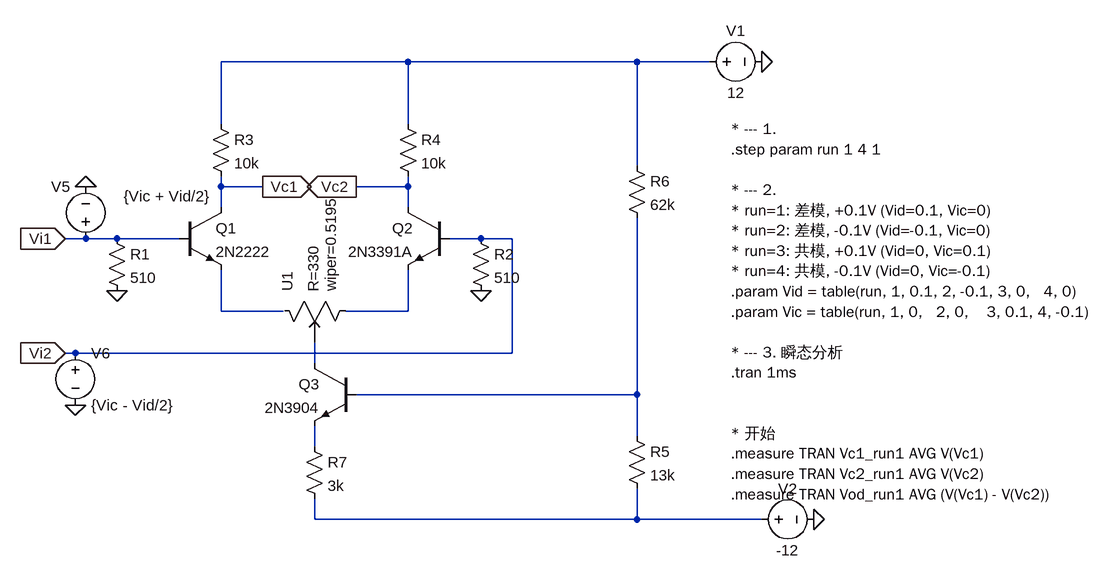
[diagram p0: schematic DifferentialAmplifierCircuit_dif_com_input.asc]
DifferentialAmplifierCircuit_dif_com_input.asc, the LTspice schematic file:
Version 4.1
SHEET 1 1044 1840
WIRE -48 -176 -336 -176
WIRE 304 -176 -48 -176
WIRE 416 -176 304 -176
WIRE -336 -80 -336 -176
WIRE -48 -80 -48 -176
WIRE 304 -16 304 -176
WIRE -336 16 -336 0
WIRE -272 16 -336 16
WIRE -48 16 -48 0
WIRE -48 16 -128 16
WIRE -336 48 -336 16
WIRE -48 48 -48 16
WIRE -544 96 -576 96
WIRE -496 96 -544 96
WIRE -400 96 -496 96
WIRE 64 96 16 96
WIRE 112 96 64 96
WIRE -336 208 -336 144
WIRE -240 208 -336 208
WIRE -48 208 -48 144
WIRE -48 208 -144 208
WIRE -560 272 -576 272
WIRE 112 272 112 96
WIRE 112 272 -560 272
WIRE -192 288 -192 256
WIRE 304 336 304 64
WIRE 304 336 -128 336
WIRE 304 400 304 336
WIRE -192 416 -192 384
WIRE -192 528 -192 496
WIRE 304 528 304 480
WIRE 304 528 -192 528
WIRE 496 528 304 528
FLAG -496 176 0
FLAG 64 176 0
FLAG -576 96 Vi1
IOPIN -576 96 In
FLAG -576 272 Vi2
IOPIN -576 272 In
FLAG -272 16 Vc1
IOPIN -272 16 Out
FLAG -128 16 Vc2
IOPIN -128 16 Out
FLAG 496 -176 0
FLAG 576 528 0
FLAG -544 16 0
FLAG -560 352 0
SYMBOL npn -400 48 R0
SYMATTR InstName Q1
SYMATTR Value 2N2222
SYMBOL npn 16 48 M0
SYMATTR InstName Q2
SYMATTR Value 2N3391A
SYMBOL npn -128 288 M0
SYMATTR InstName Q3
SYMATTR Value 2N3904
SYMBOL res -512 80 R0
SYMATTR InstName R1
SYMATTR Value 510
SYMBOL res 48 80 R0
SYMATTR InstName R2
SYMATTR Value 510
SYMBOL res -352 -96 R0
SYMATTR InstName R3
SYMATTR Value 10k
SYMBOL res -64 -96 R0
SYMATTR InstName R4
SYMATTR Value 10k
SYMBOL res 288 384 R0
SYMATTR InstName R5
SYMATTR Value 13k
SYMBOL res 288 -32 R0
SYMATTR InstName R6
SYMATTR Value 62k
SYMBOL res -208 400 R0
SYMATTR InstName R7
SYMATTR Value 3k
SYMBOL voltage 400 -176 R270
WINDOW 0 32 56 VTop 2
WINDOW 3 -32 56 VBottom 2
WINDOW 123 0 0 Left 0
WINDOW 39 0 0 Left 0
SYMATTR InstName V1
SYMATTR Value 12
SYMBOL voltage 480 528 R270
WINDOW 0 32 56 VTop 2
WINDOW 3 -32 56 VBottom 2
WINDOW 123 0 0 Left 0
WINDOW 39 0 0 Left 0
SYMATTR InstName V2
SYMATTR Value -12
SYMBOL potentiometer -144 208 R270
SYMATTR InstName U1
SYMATTR SpiceLine R=330
SYMATTR SpiceLine2 wiper=0.5195
SYMBOL voltage -544 112 R180
WINDOW 0 24 96 Left 2
WINDOW 3 -190 81 Left 2
WINDOW 123 0 0 Left 0
WINDOW 39 0 0 Left 0
SYMATTR InstName V5
SYMATTR Value {Vic + Vid/2}
SYMBOL voltage -560 256 R0
WINDOW 123 0 0 Left 0
WINDOW 39 0 0 Left 0
SYMATTR InstName V6
SYMATTR Value {Vic - Vid/2}
TEXT 448 -72 Left 2 !* --- 1. \n.step param run 1 4 1\n \n* --- 2. \n* run=1: 差模, +0.1V (Vid=0.1, Vic=0)\n* run=2: 差模, -0.1V (Vid=-0.1, Vic=0)\n* run=3: 共模, +0.1V (Vid=0, Vic=0.1)\n* run=4: 共模, -0.1V (Vid=0, Vic=-0.1)\n.param Vid = table(run, 1, 0.1, 2, -0.1, 3, 0,   4, 0)\n.param Vic = table(run, 1, 0,   2, 0,    3, 0.1, 4, -0.1)\n \n* --- 3. 瞬态分析\n.tran 1ms\n \n \n* 开始\n.measure TRAN Vc1_run1 AVG V(Vc1)\n.measure TRAN Vc2_run1 AVG V(Vc2)\n.measure TRAN Vod_run1 AVG (V(Vc1) - V(Vc2))

The netlist it stands for:
* DifferentialAmplifierCircuit_dif_com_input.asc
Q1 Vc1 Vi1 N002 0 2N2222
Q2 Vc2 Vi2 N003 0 2N3391A
Q3 N004 N005 N006 0 2N3904
R1 Vi1 0 510
R2 Vi2 0 510
R3 N001 Vc1 10k
R4 N001 Vc2 10k
R5 N005 N007 13k
R6 N001 N005 62k
R7 N006 N007 3k
V1 N001 0 12
V2 N007 0 -12
X§U1 N002 N003 N004 potentiometer R=330 wiper=0.5195  ; pins 1 2 3
V5 Vi1 0 {Vic + Vid/2}
V6 Vi2 0 {Vic - Vid/2}
.model NPN NPN
.model PNP PNP
.lib standard.bjt
* --- 1.
.step param run 1 4 1
* --- 2.
* run=1: 差模, +0.1V (Vid=0.1, Vic=0)
* run=2: 差模, -0.1V (Vid=-0.1, Vic=0)
* run=3: 共模, +0.1V (Vid=0, Vic=0.1)
* run=4: 共模, -0.1V (Vid=0, Vic=-0.1)
.param Vid = table(run, 1, 0.1, 2, -0.1, 3, 0,   4, 0)
.param Vic = table(run, 1, 0,   2, 0,    3, 0.1, 4, -0.1)
* --- 3. 瞬态分析
.tran 1ms
* 开始
.measure TRAN Vc1_run1 AVG V(Vc1)
.measure TRAN Vc2_run1 AVG V(Vc2)
.measure TRAN Vod_run1 AVG (V(Vc1) - V(Vc2))
.lib potentiometer.lib
.backanno
.end